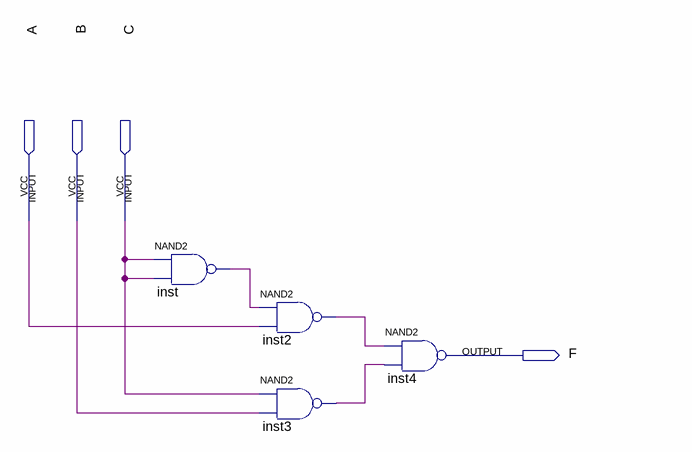
[diagram p0: schematic sheet]
// Quartus schematic q43.bdf as structural Verilog: 4 symbols, 4 pins
module q43 (
  input  A,
  input  B,
  input  C,
  output F
);

  wire inst2_out, inst3_out, inst_out;

  nand inst (inst_out, C, C);
  nand inst2 (inst2_out, inst_out, A);
  nand inst3 (inst3_out, C, B);
  nand inst4 (F, inst2_out, inst3_out);
endmodule
